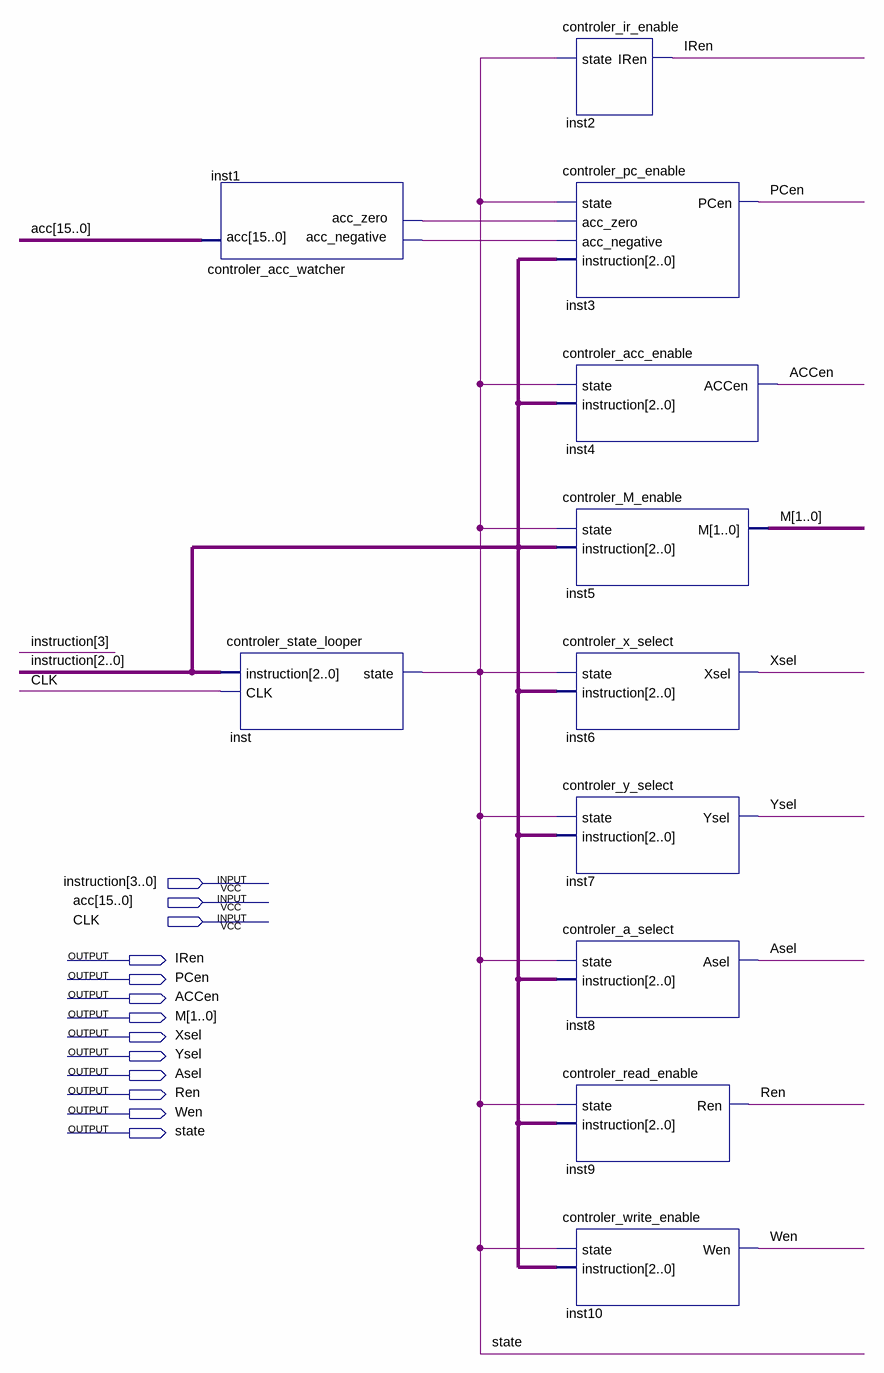
[diagram p0: schematic sheet]
// Quartus schematic controler.bdf as structural Verilog: 11 symbols, 13 pins
module controler (
  input  [3:0] instruction,
  input  [15:0] acc,
  input  CLK,
  output IRen,
  output PCen,
  output ACCen,
  output [1:0] M,
  output Xsel,
  output Ysel,
  output Asel,
  output Ren,
  output Wen,
  output state
);

  wire inst1_acc_negative, inst1_acc_zero;

  controler_acc_watcher inst1 (.acc(acc), .acc_negative(inst1_acc_negative), .acc_zero(inst1_acc_zero));
  controler_state_looper inst (.instruction(instruction[2:0]), .CLK(CLK), .state(state));
  controler_ir_enable inst2 (.state(state), .IRen(IRen));
  controler_pc_enable inst3 (
    .state(state), .acc_zero(inst1_acc_zero), .acc_negative(inst1_acc_negative),
    .instruction(instruction[2:0]), .PCen(PCen));
  controler_acc_enable inst4 (.state(state), .instruction(instruction[2:0]), .ACCen(ACCen));
  controler_M_enable inst5 (.state(state), .instruction(instruction[2:0]), .M(M));
  controler_x_select inst6 (.state(state), .instruction(instruction[2:0]), .Xsel(Xsel));
  controler_y_select inst7 (.state(state), .instruction(instruction[2:0]), .Ysel(Ysel));
  controler_a_select inst8 (.state(state), .instruction(instruction[2:0]), .Asel(Asel));
  controler_read_enable inst9 (.state(state), .instruction(instruction[2:0]), .Ren(Ren));
  controler_write_enable inst10 (.state(state), .instruction(instruction[2:0]), .Wen(Wen));
endmodule
